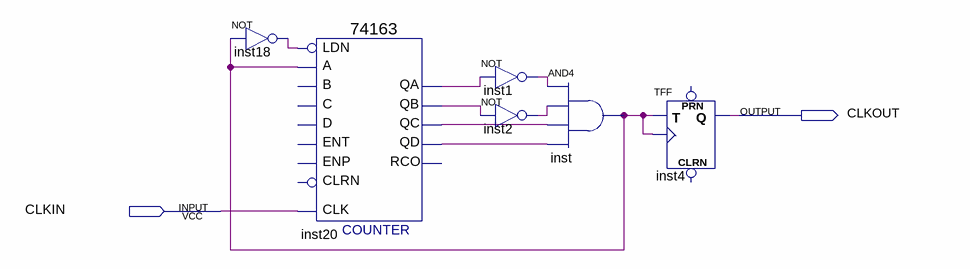
[diagram p0: schematic sheet]
// Quartus schematic Divider.bdf as structural Verilog: 6 symbols, 2 pins
module Divider (
  input  CLKIN,
  output CLKOUT
);

  wire inst1_out, inst2_out, inst18_out, inst20_qa, inst20_qb, inst20_qc, inst20_qd, inst_out;

  not inst18 (inst18_out, inst_out);
  \74163  inst20 (
    .A(inst_out), .CLK(CLKIN), .LDN(inst18_out), .QA(inst20_qa), .QB(inst20_qb), .QC(inst20_qc),
    .QD(inst20_qd));  // open: C, B, ENT, D, CLRN, ENP, RCO
  not inst1 (inst1_out, inst20_qa);
  not inst2 (inst2_out, inst20_qb);
  and inst (inst_out, inst1_out, inst2_out, inst20_qc, inst20_qd);
  TFF inst4 (.T(inst_out), .CLK(inst_out), .Q(CLKOUT));  // open: PRN, CLRN
endmodule
